# Altium project MIKSER_SIROVINE.PrjPcb (part 2 of 2)

## Sheet AnalogOutput.SchDoc: Analog output
size A3; Author: eldar6776@hotmail.com; DrawnBy: Eldar Dediæ; Organization: PROVEN d.o.o.; Address1: Adema Buæe 102; Address2: 71000 Sarajevo; Address3: Federacija BiH; Address4: Bosna i Hercegovina; DocumentNumber: DE211213; Revision: 001; SheetNumber: 6; SheetTotal: 15; ProjectName: MIKSER SIROVINE
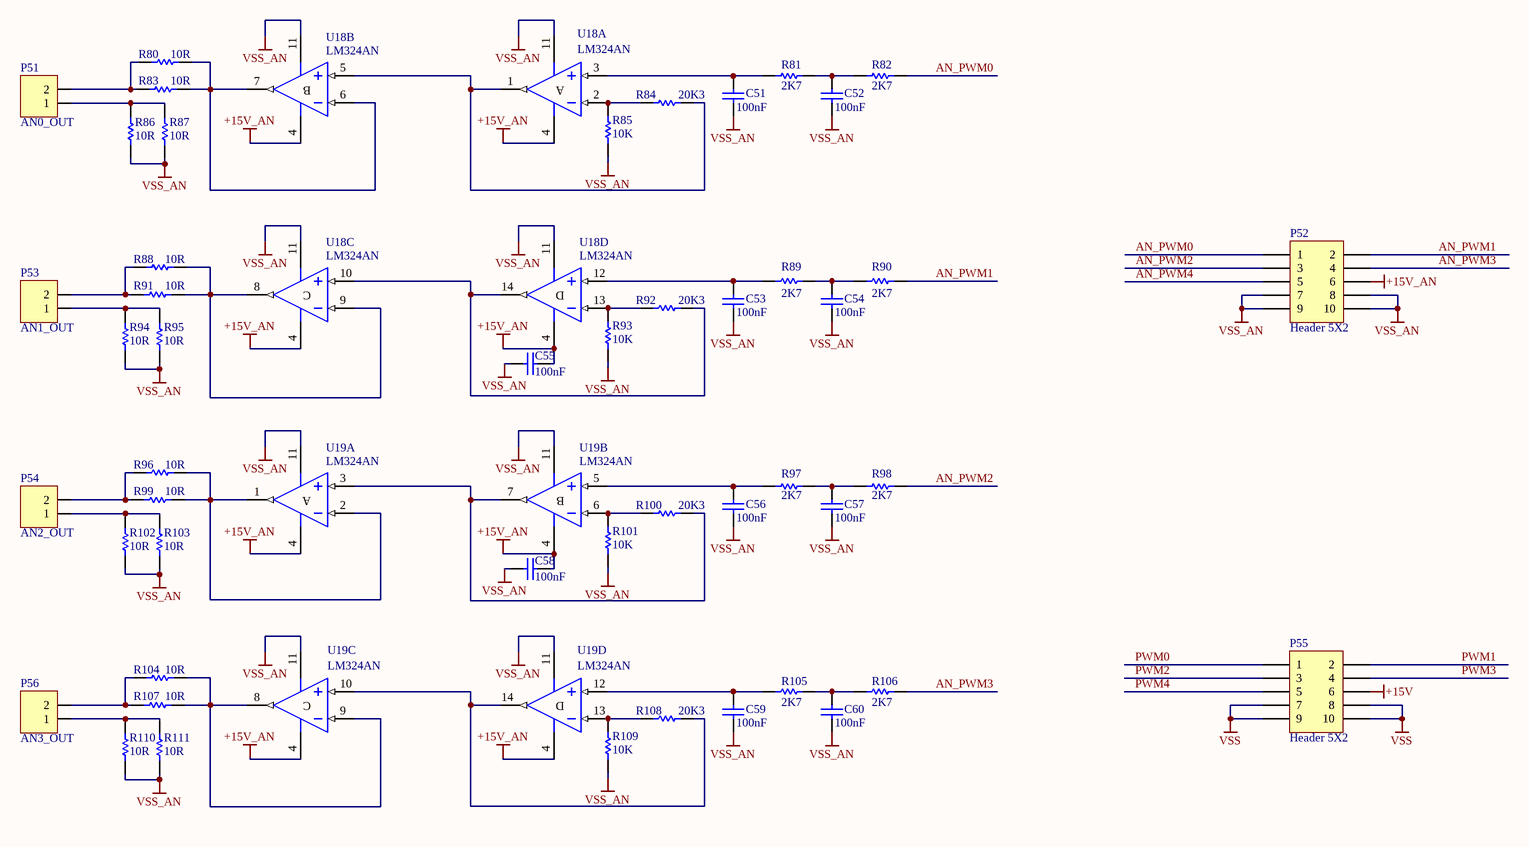
[diagram p5: AnalogOutput.SchDoc]

### Parts
C51  value 100nF  [1206]
C52  value 100nF  [1206]
C53  value 100nF  [1206]
C54  value 100nF  [1206]
C55  value 100nF  [1206]
C56  value 100nF  [1206]
C57  value 100nF  [1206]
C58  value 100nF  [1206]
C59  value 100nF  [1206]
C60  value 100nF  [1206]
P51  AN0_OUT  [TERMINAL BLOK 2]
P52  Header 5X2  [HDR2X5]
P53  AN1_OUT  [TERMINAL BLOK 2]
P54  AN2_OUT  [TERMINAL BLOK 2]
P55  Header 5X2  [HDR2X5]
P56  AN3_OUT  [TERMINAL BLOK 2]
R80  10R  [ERA-0603]
R81  2K7  [ERA-0603]
R82  2K7  [ERA-0603]
R83  10R  [ERA-0603]
R84  20K3  [ERA-0603]
R85  10K  [ERA-0603]
R86  10R  [ERA-0603]
R87  10R  [ERA-0603]
R88  10R  [ERA-0603]
R89  2K7  [ERA-0603]
R90  2K7  [ERA-0603]
R91  10R  [ERA-0603]
R92  20K3  [ERA-0603]
R93  10K  [ERA-0603]
R94  10R  [ERA-0603]
R95  10R  [ERA-0603]
R96  10R  [ERA-0603]
R97  2K7  [ERA-0603]
R98  2K7  [ERA-0603]
R99  10R  [ERA-0603]
R100  20K3  [ERA-0603]
R101  10K  [ERA-0603]
R102  10R  [ERA-0603]
R103  10R  [ERA-0603]
R104  10R  [ERA-0603]
R105  2K7  [ERA-0603]
R106  2K7  [ERA-0603]
R107  10R  [ERA-0603]
R108  20K3  [ERA-0603]
R109  10K  [ERA-0603]
R110  10R  [ERA-0603]
R111  10R  [ERA-0603]
U18  LM324AN  [DIP14]  (parts A,B,C,D of 4)
U19  LM324AN  [DIP14]  (parts A,B,C,D of 4)

### Nets
+15V: P55.6
+15V_AN: C55.1 C58.1 P52.6 U18.4(V+) U19.4(V+)
VSS: P55.7 P55.8 P55.9 P55.10
VSS_AN: C51.1 C52.1 C53.1 C54.1 C55.2 C56.1 C57.1 C58.2 C59.1 C60.1 P52.7 P52.8 P52.9 P52.10 R85.1 R86.1 R87.1 R93.1 R94.1 R95.1 R101.1 R102.1 R103.1 R109.1 R110.1 R111.1 U18.11(V-) U19.11(V-)
AN_PWM0: P52.1 R82.2
AN_PWM1: P52.2 R90.2
AN_PWM2: P52.3 R98.2
AN_PWM3: P52.4 R106.2
AN_PWM4: P52.5
PWM0: P55.1
PWM1: P55.2
PWM2: P55.3
PWM3: P55.4
PWM4: P55.5
NetC51_2: C51.2 R81.1 U18.3(IN+)
NetC52_2: C52.2 R81.2 R82.1
NetC53_2: C53.2 R89.1 U18.12(IN+)
NetC54_2: C54.2 R89.2 R90.1
NetC56_2: C56.2 R97.1 U19.5(IN+)
NetC57_2: C57.2 R97.2 R98.1
NetC59_2: C59.2 R105.1 U19.12(IN+)
NetC60_2: C60.2 R105.2 R106.1
NetP51_1: P51.1 R86.2 R87.2
NetP51_2: P51.2 R80.2 R83.2
NetP53_1: P53.1 R94.2 R95.2
NetP53_2: P53.2 R88.2 R91.2
NetP54_1: P54.1 R102.2 R103.2
NetP54_2: P54.2 R96.2 R99.2
NetP56_1: P56.1 R110.2 R111.2
NetP56_2: P56.2 R104.2 R107.2
NetR80_1: R80.1 R83.1 U18.6(IN-) U18.7(OUT)
NetR84_1: R84.1 R85.2 U18.2(IN-)
NetR84_2: R84.2 U18.1(OUT) U18.5(IN+)
NetR88_1: R88.1 R91.1 U18.8(OUT) U18.9(IN-)
NetR92_1: R92.1 R93.2 U18.13(IN-)
NetR92_2: R92.2 U18.10(IN+) U18.14(OUT)
NetR96_1: R96.1 R99.1 U19.1(OUT) U19.2(IN-)
NetR100_1: R100.1 R101.2 U19.6(IN-)
NetR100_2: R100.2 U19.3(IN+) U19.7(OUT)
NetR104_1: R104.1 R107.1 U19.8(OUT) U19.9(IN-)
NetR108_1: R108.1 R109.2 U19.13(IN-)
NetR108_2: R108.2 U19.10(IN+) U19.14(OUT)

### Notes on the sheet
- Title
- Size:
- Date:
- A3
- Number:
- Time:
- Revision:
- Sheet
- of
- File:
- (in symbol LM324AN, part A) A
- (in symbol LM324AN, part B) B
- (in symbol LM324AN, part C) C
- (in symbol LM324AN, part D) D

### Library data of the parts
C51-C60 = C1206: Ceramic Chip Capacitor - Standard; Published: 17-Jul-2002; LatestRevisionDate: 19-Mar-2004; LatestRevisionNote: Silkscreen size reduced.; DatasheetDocument: Mar-2001; PackageDocument: Mar-2001; PackageReference: 1206; Publisher: Altium Limited; Code_JEITA: 1206; Code_IPC: 3216 [1206]; ComponentLink1Description: Manufacturer Link; ComponentLink1URL: http://www.kemet.com/; ComponentLink2Description: Datasheet; ComponentLink2URL: http://www.kemet.com/kemet/web/homepage/kechome.nsf/vapubfilesname/F3102TA.pdf/$file/F3102TA.pdf
P51 P53 P54 P56 = TERMINAL BLOK 2: Terminal blok konektor 3,5 mm
P52 P55 = Header 5X2: Header, 5-Pin, Dual row; LatestRevisionDate: 17-Jul-2002; LatestRevisionNote: Re-released for DXP Platform.; Publisher: Altium Limited
R80-R111 = ERA3Y: Rectangular Thick Film Chip Resistor, 10 Ohm to 330k Ohm Range, 0.1% and 0.5% Tolerance, 0603 Size, 0.063 W; Note: If flow soldering, adjust pad width of PCB Footprint to 0.7 - 0.8 times the width of the resistor.; Published: 17-Dec-2003; LatestRevisionDate: 19-Mar-2004; LatestRevisionNote: Silkscreen size reduced.; PackageDocument: Mar-2003; PackageReference: ERA-0603; Publisher: Altium Limited; Code_IPC: 1608 [0603]; ComponentLink1Description: Manufacturer Link; ComponentLink1URL: http://www.panasonic.com/industrial/components/resistive_products.htm; ComponentLink2Description: Datasheet; ComponentLink2URL: http://www.panasonic.com/industrial/components/pdf/AOA0000CE8.pdf
U18 U19 = LM324AN: Low-Power Quad Operational Amplifier; Published: 24-Aug-2001; LatestRevisionDate: 06-Jun-2005; LatestRevisionNote: Stylized 3D Model Added.; DatasheetVersion: Nov-1997; PackageVersion: Jan-1997; PackageReference: DIP14; Publisher: Altium Limited; PackageDescription: DIP; 14 Leads; Row Spacing 7.62 mm; Pitch 2.54 mm; ComponentLink1Description: Manufacturer Link; ComponentLink1URL: http://www.st.com/; ComponentLink2Description: Datasheet; ComponentLink2URL: http://www.st.com/stonline/products/literature/ds/4797/lm224a.pdf

## Sheet CuC_ControlComm.SchDoc: CuC Control Comm
size A4; Author: eldar6776@hotmail.com; DrawnBy: Eldar Dedić; Organization: PROVEN d.o.o.; Address1: Adema Buće 102; Address2: 71000 Sarajevo; Address3: Federacija BiH; Address4: Bosna i Hercegovina; DocumentNumber: DE211213; Revision: 001; SheetNumber: 7; SheetTotal: 15; ProjectName: MIKSER SIROVINE
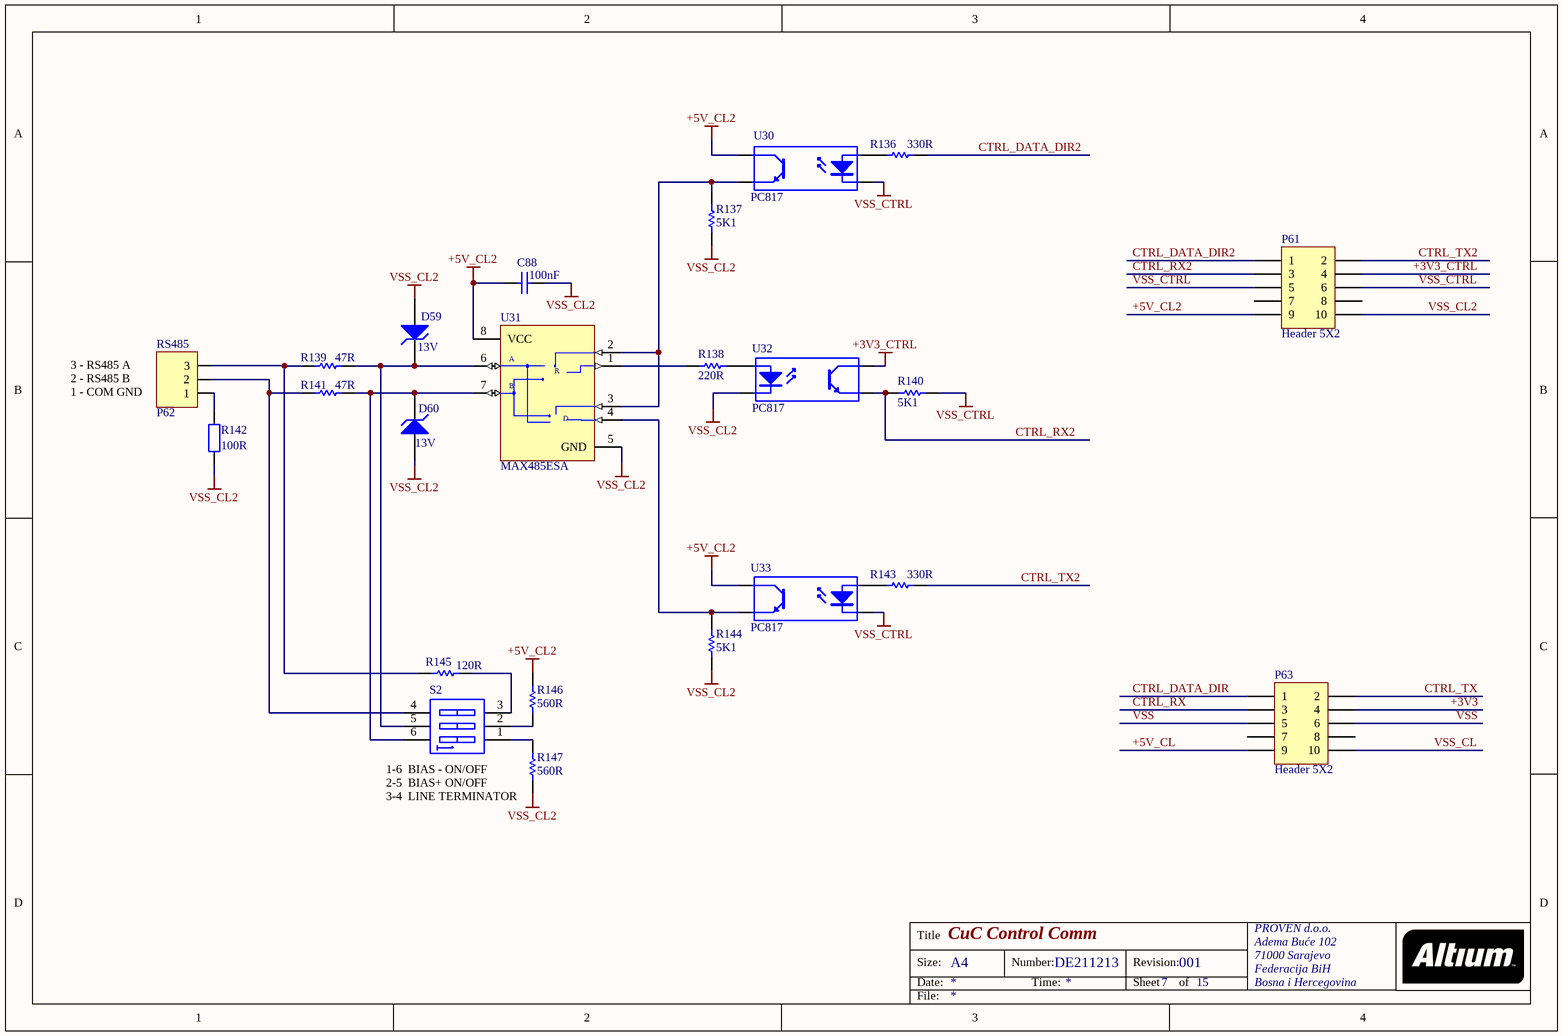
[diagram p6: CuC_ControlComm.SchDoc]

### Parts
C88  100nF  [1206]
D59  13V  [DO-35A]
D60  13V  [DO-35A]
P61  Header 5X2  [HDR2X5]
P62  RS485  [TERMINAL BLOK 3]
P63  Header 5X2  [HDR2X5]
R136  330R  [ERA-0805]
R137  5K1  [8-1206]
R138  220R  [ERA-0805]
R139  47R  [ERA-0805]
R140  5K1  [8-1206]
R141  47R  [ERA-0805]
R142  100R  [AXIAL-0.4]
R143  330R  [ERA-0805]
R144  5K1  [8-1206]
R145  120R  [ERA-0805]
R146  560R  [ERA-0805]
R147  560R  [ERA-0805]
S2  (no value)  [DIP-6]
U30  PC817  [DIP-4]
U31  MAX485ESA  [NSO8_N]
U32  PC817  [DIP-4]
U33  PC817  [DIP-4]

### Nets
+3V3: P63.4
+3V3_CTRL: P61.4 U32.4(C)
+5V_CL: P63.9
+5V_CL2: C88.2 P61.9 R146.2 U30.4(C) U31.8(VCC) U33.4(C)
VSS: P63.5 P63.6
VSS_CL: P63.10
VSS_CL2: C88.1 D59.1(A) D60.1(A) P61.10 R137.1 R142.1 R144.1 R147.1 U31.5(GND) U32.2(K)
VSS_CTRL: P61.5 P61.6 R140.2 U30.2(K) U33.2(K)
CTRL_DATA_DIR: P63.1
CTRL_DATA_DIR2: P61.1 R136.2
CTRL_RX: P63.3
CTRL_RX2: P61.3 R140.1 U32.3(E)
CTRL_TX: P63.2
CTRL_TX2: P61.2 R143.2
NetD59_2: D59.2(K) R139.2 S2.5(B2) U31.6(A)
NetD60_2: D60.2(K) R141.2 S2.6(B1) U31.7(B)
NetP62_1: P62.1 R142.2
NetP62_2: P62.2 R141.1 S2.4(B3)
NetP62_3: P62.3 R139.1 R145.1
NetR136_1: R136.1 U30.1(A)
NetR137_2: R137.2 U30.3(E) U31.2(~{RE}) U31.3(DE)
NetR138_1: R138.1 U32.1(A)
NetR138_2: R138.2 U31.1(RO)
NetR143_1: R143.1 U33.1(A)
NetR144_2: R144.2 U31.4(DI) U33.3(E)
NetR145_2: R145.2 S2.3(A3)
NetR146_1: R146.1 S2.2(A2)
NetR147_2: R147.2 S2.1(A1)

Not connected (* = marked no-connect by the designer): P61 7 8; P63 7 8

### Notes on the sheet
- 3 - RS485 A
  2 - RS485 B
  1 - COM GND
- (near R147) 1-6  BIAS - ON/OFF
  2-5  BIAS+ ON/OFF
  3-4  LINE TERMINATOR
- Title
- Size:
- Date:
- A4
- Number:
- Time:
- Revision:
- Sheet
- of
- File:
- (in symbol MAX485ESA) R; D

### Library data of the parts
C88 = C1206: Ceramic Chip Capacitor - Standard; Published: 17-Jul-2002; LatestRevisionDate: 19-Mar-2004; LatestRevisionNote: Silkscreen size reduced.; DatasheetDocument: Mar-2001; PackageDocument: Mar-2001; PackageReference: 1206; Publisher: Altium Limited; Code_JEITA: 1206; Code_IPC: 3216 [1206]; ComponentLink1Description: Manufacturer Link; ComponentLink1URL: http://www.kemet.com/; ComponentLink2Description: Datasheet; ComponentLink2URL: http://www.kemet.com/kemet/web/homepage/kechome.nsf/vapubfilesname/F3102TA.pdf/$file/F3102TA.pdf
D59 D60 = D Zener: Zener Diode; Published: 8-Jun-2000; LatestRevisionDate: 17-Jul-2002; LatestRevisionNote: Re-released for DXP Platform.; PackageReference: DIODE-0.7; Publisher: Altium Limited; PackageDescription: Diode, Thru-Hole; 2 Leads; 0.7 in Pin Spacing
P61 P63 = Header 5X2: Header, 5-Pin, Dual row; LatestRevisionDate: 17-Jul-2002; LatestRevisionNote: Re-released for DXP Platform.; Publisher: Altium Limited
P62 = TERMINAL BLOK 3: 3 pinski terminal blok konektor
R136 R143 = ERA6Y: Rectangular Thick Film Chip Resistor, 10 Ohm to 1M Ohm Range, 0.1% and 0.5% Tolerance, 0805 Size, 0.1 W; Note: If flow soldering, adjust pad width of PCB Footprint to 0.7 - 0.8 times the width of the resistor.; Published: 17-Dec-2003; LatestRevisionDate: 19-Mar-2004; LatestRevisionNote: Silkscreen size reduced.; PackageDocument: Mar-2003; PackageReference: ERA-0805; Publisher: Altium Limited; Code_IPC: 2012 [0805]; ComponentLink1Description: Manufacturer Link; ComponentLink1URL: http://www.panasonic.com/industrial/components/resistive_products.htm; ComponentLink2Description: Datasheet; ComponentLink2URL: http://www.panasonic.com/industrial/components/pdf/AOA0000CE8.pdf
R137 R140 R144 = ERJ8GE: Thick Film Chip Resistor, 1 Ohm to 10M Ohm Range, 5% Tolerance, 1206 Size, 0.25 W; Note: If flow soldering, adjust pad width of PCB Footprint to 0.7 - 0.8 times the width of the resistor.; Published: 17-Dec-2003; LatestRevisionDate: 19-Mar-2004; LatestRevisionNote: Silkscreen size reduced.; PackageDocument: Mar-2003; PackageReference: 8-1206; Publisher: Altium Limited; Code_IPC: 3216 [1206]; ComponentLink1Description: Manufacturer Link; ComponentLink1URL: http://www.panasonic.com/industrial/components/resistive_products.htm; ComponentLink2Description: Datasheet; ComponentLink2URL: http://www.panasonic.com/industrial/components/pdf/AOA0000CE1.pdf
R138 R139 R141 R145-R147 = ERAS: Metal Film Thermosensitive Chip Resistor, 0.56 Ohm to 10k Ohm Range, 5% Tolerance, 0805 Size, 0.1 W; Note: If flow soldering, adjust pad width of PCB Footprint to 0.7 - 0.8 times the width of the resistor.; Published: 17-Dec-2003; LatestRevisionDate: 19-Mar-2004; LatestRevisionNote: Silkscreen size reduced.; PackageDocument: Mar-2003; PackageReference: ERA-0805; Publisher: Altium Limited; Code_IPC: 2012 [0805]; ComponentLink1Description: Manufacturer Link; ComponentLink1URL: http://www.panasonic.com/industrial/components/resistive_products.htm; ComponentLink2Description: Datasheet; ComponentLink2URL: http://www.panasonic.com/industrial/components/pdf/AOF0000CE1.pdf
R142 = Res2: Resistor; Published: 8-Jun-2000; LatestRevisionDate: 17-Jul-2002; LatestRevisionNote: Re-released for DXP Platform.; PackageReference: AXIAL-0.4; Publisher: Altium Limited; PackageDescription: Axial Device, Thru-Hole; 2 Leads; 0.4 in Pin Spacing
S2 = SW DIP-3: DIP Switch, 3 Position, SPST; Published: 24-Mar-1999; LatestRevisionDate: 17-Jul-2002; LatestRevisionNote: Re-released for DXP Platform.; PackageReference: DIP-6; Publisher: Altium Limited; Code_JEDEC: MO-001-AM
U30 U32 U33 = Optoisolator1: 4-Pin Phototransistor Optocoupler; Published: 24-Mar-1999; LatestRevisionDate: 04-Mar-2005; LatestRevisionNote: Sch pins 3 & 4 Swapped.; DatasheetVersion: Nov-2003; PackageReference: DIP-4; Publisher: Altium Limited
U31 = MAX485ESA: Low-Power, Slew-Rate-Limited RS-485/RS-422 Transceiver; Published: 16-Jan-2001; LatestRevisionDate: 13-Apr-2006; LatestRevisionNote: IPC-7351 Footprint Added.; DatasheetVersion: Feb-1996; PackageReference: NSO8; Publisher: Altium Limited; PackageDescription: 8-Pin Small Outline Integrated Circuit 1.27 mm Pitch; Code_JEDEC: MS-012-AA; Code_IPC: SOIC127P600-8; ComponentLink1Description: Manufacturer Link; ComponentLink1URL: http://www.maxim-ic.com/; ComponentLink2Description: Datasheet; ComponentLink2URL: http://pdfserv.maxim-ic.com/en/ds/MAX1487-MAX491.pdf

## Sheet CuC_DataComm.SchDoc: CuC Data Comm
size A4; Author: eldar6776@hotmail.com; DrawnBy: Eldar Dedić; Organization: PROVEN d.o.o.; Address1: Adema Buće 102; Address2: 71000 Sarajevo; Address3: Federacija BiH; Address4: Bosna i Hercegovina; DocumentNumber: DE211213; Revision: 001; SheetNumber: 8; SheetTotal: 15; ProjectName: MIKSER SIROVINE
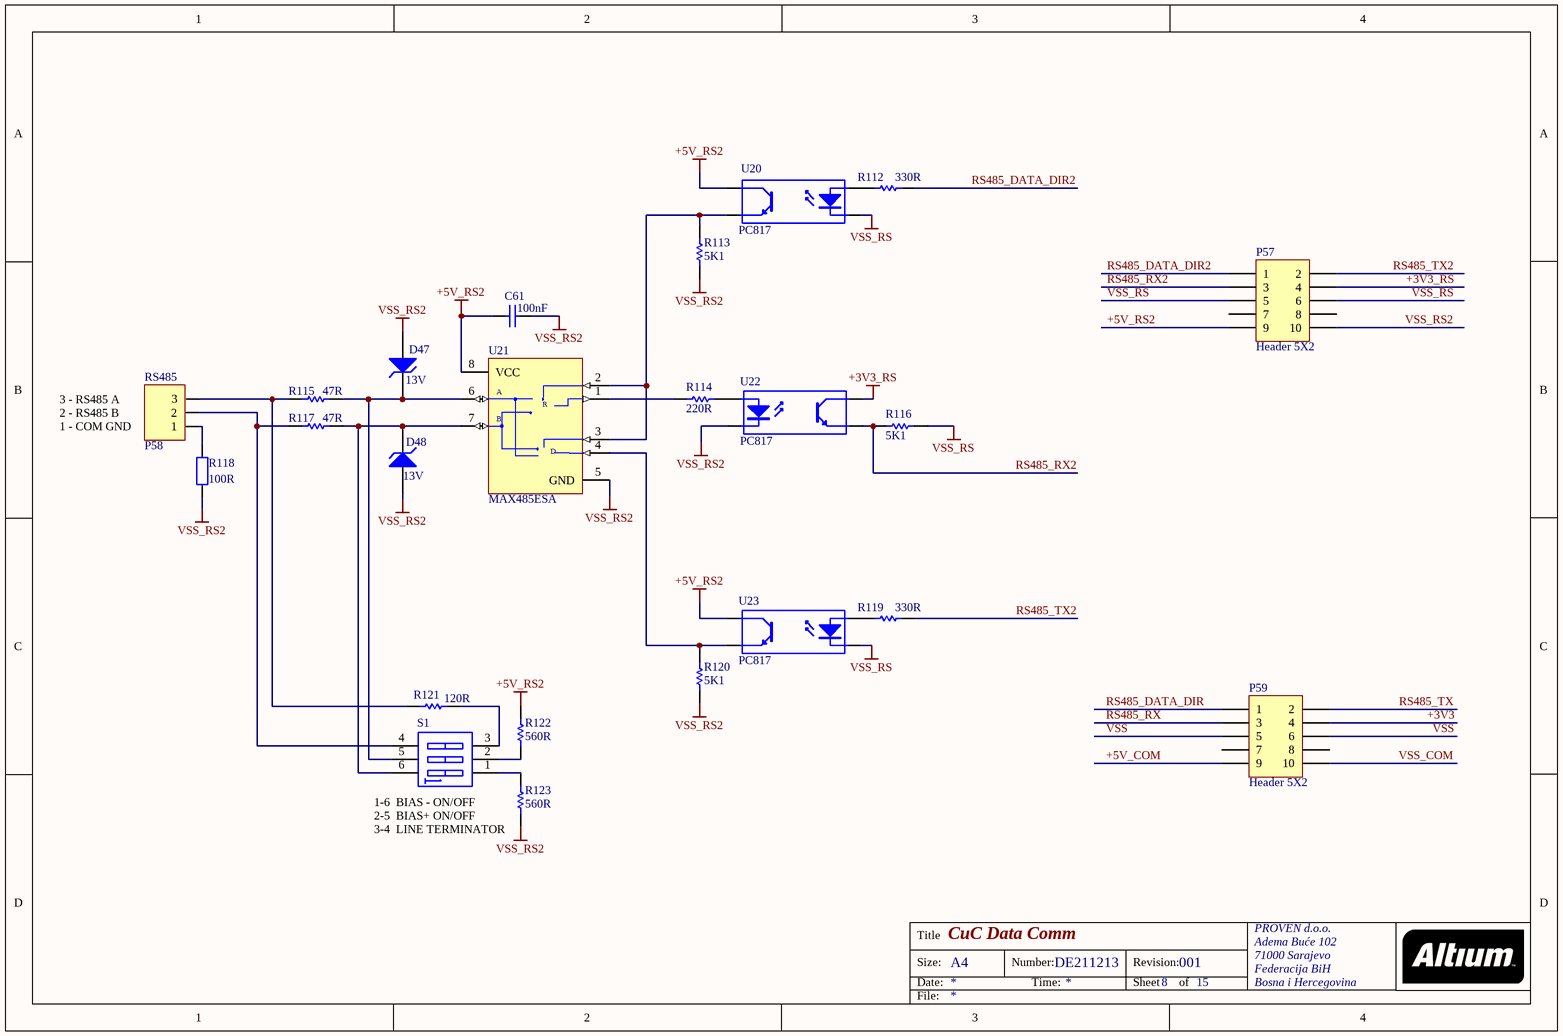
[diagram p7: CuC_DataComm.SchDoc]

### Parts
C61  100nF  [1206]
D47  13V  [DO-35A]
D48  13V  [DO-35A]
P57  Header 5X2  [HDR2X5]
P58  RS485  [TERMINAL BLOK 3]
P59  Header 5X2  [HDR2X5]
R112  330R  [ERA-0805]
R113  5K1  [8-1206]
R114  220R  [ERA-0805]
R115  47R  [ERA-0805]
R116  5K1  [8-1206]
R117  47R  [ERA-0805]
R118  100R  [AXIAL-0.4]
R119  330R  [ERA-0805]
R120  5K1  [8-1206]
R121  120R  [ERA-0805]
R122  560R  [ERA-0805]
R123  560R  [ERA-0805]
S1  (no value)  [DIP-6]
U20  PC817  [DIP-4]
U21  MAX485ESA  [NSO8_N]
U22  PC817  [DIP-4]
U23  PC817  [DIP-4]

### Nets
+3V3: P59.4
+3V3_RS: P57.4 U22.4(C)
+5V_COM: P59.9
+5V_RS2: C61.2 P57.9 R122.2 U20.4(C) U21.8(VCC) U23.4(C)
VSS: P59.5 P59.6
VSS_COM: P59.10
VSS_RS: P57.5 P57.6 R116.2 U20.2(K) U23.2(K)
VSS_RS2: C61.1 D47.1(A) D48.1(A) P57.10 R113.1 R118.1 R120.1 R123.1 U21.5(GND) U22.2(K)
RS485_DATA_DIR: P59.1
RS485_DATA_DIR2: P57.1 R112.2
RS485_RX: P59.3
RS485_RX2: P57.3 R116.1 U22.3(E)
RS485_TX: P59.2
RS485_TX2: P57.2 R119.2
NetD47_2: D47.2(K) R115.2 S1.5(B2) U21.6(A)
NetD48_2: D48.2(K) R117.2 S1.6(B1) U21.7(B)
NetP58_1: P58.1 R118.2
NetP58_2: P58.2 R117.1 S1.4(B3)
NetP58_3: P58.3 R115.1 R121.1
NetR112_1: R112.1 U20.1(A)
NetR113_2: R113.2 U20.3(E) U21.2(~{RE}) U21.3(DE)
NetR114_1: R114.1 U22.1(A)
NetR114_2: R114.2 U21.1(RO)
NetR119_1: R119.1 U23.1(A)
NetR120_2: R120.2 U21.4(DI) U23.3(E)
NetR121_2: R121.2 S1.3(A3)
NetR122_1: R122.1 S1.2(A2)
NetR123_2: R123.2 S1.1(A1)

Not connected (* = marked no-connect by the designer): P57 7 8; P59 7 8

### Notes on the sheet
- 3 - RS485 A
  2 - RS485 B
  1 - COM GND
- (near R123) 1-6  BIAS - ON/OFF
  2-5  BIAS+ ON/OFF
  3-4  LINE TERMINATOR
- Title
- Size:
- Date:
- A4
- Number:
- Time:
- Revision:
- Sheet
- of
- File:
- (in symbol MAX485ESA) R; D

### Library data of the parts
C61 = C1206: Ceramic Chip Capacitor - Standard; Published: 17-Jul-2002; LatestRevisionDate: 19-Mar-2004; LatestRevisionNote: Silkscreen size reduced.; DatasheetDocument: Mar-2001; PackageDocument: Mar-2001; PackageReference: 1206; Publisher: Altium Limited; Code_JEITA: 1206; Code_IPC: 3216 [1206]; ComponentLink1Description: Manufacturer Link; ComponentLink1URL: http://www.kemet.com/; ComponentLink2Description: Datasheet; ComponentLink2URL: http://www.kemet.com/kemet/web/homepage/kechome.nsf/vapubfilesname/F3102TA.pdf/$file/F3102TA.pdf
D47 D48 = D Zener: Zener Diode; Published: 8-Jun-2000; LatestRevisionDate: 17-Jul-2002; LatestRevisionNote: Re-released for DXP Platform.; PackageReference: DIODE-0.7; Publisher: Altium Limited; PackageDescription: Diode, Thru-Hole; 2 Leads; 0.7 in Pin Spacing
P57 P59 = Header 5X2: Header, 5-Pin, Dual row; LatestRevisionDate: 17-Jul-2002; LatestRevisionNote: Re-released for DXP Platform.; Publisher: Altium Limited
P58 = TERMINAL BLOK 3: 3 pinski terminal blok konektor
R112 R119 = ERA6Y: as R136 on sheet CuC_ControlComm; Published: 17-Dec-2003; LatestRevisionDate: 19-Mar-2004; LatestRevisionNote: Silkscreen size reduced.; PackageDocument: Mar-2003; PackageReference: ERA-0805; Publisher: Altium Limited; Code_IPC: 2012 [0805]; ComponentLink1Description: Manufacturer Link; ComponentLink1URL: http://www.panasonic.com/industrial/components/resistive_products.htm; ComponentLink2Description: Datasheet; ComponentLink2URL: http://www.panasonic.com/industrial/components/pdf/AOA0000CE8.pdf
R113 R116 R120 = ERJ8GE: as R137 on sheet CuC_ControlComm; Published: 17-Dec-2003; LatestRevisionDate: 19-Mar-2004; LatestRevisionNote: Silkscreen size reduced.; PackageDocument: Mar-2003; PackageReference: 8-1206; Publisher: Altium Limited; Code_IPC: 3216 [1206]; ComponentLink1Description: Manufacturer Link; ComponentLink1URL: http://www.panasonic.com/industrial/components/resistive_products.htm; ComponentLink2Description: Datasheet; ComponentLink2URL: http://www.panasonic.com/industrial/components/pdf/AOA0000CE1.pdf
R114 R115 R117 R121-R123 = ERAS: as R138 on sheet CuC_ControlComm; Published: 17-Dec-2003; LatestRevisionDate: 19-Mar-2004; LatestRevisionNote: Silkscreen size reduced.; PackageDocument: Mar-2003; PackageReference: ERA-0805; Publisher: Altium Limited; Code_IPC: 2012 [0805]; ComponentLink1Description: Manufacturer Link; ComponentLink1URL: http://www.panasonic.com/industrial/components/resistive_products.htm; ComponentLink2Description: Datasheet; ComponentLink2URL: http://www.panasonic.com/industrial/components/pdf/AOF0000CE1.pdf
R118 = Res2: Resistor; Published: 8-Jun-2000; LatestRevisionDate: 17-Jul-2002; LatestRevisionNote: Re-released for DXP Platform.; PackageReference: AXIAL-0.4; Publisher: Altium Limited; PackageDescription: Axial Device, Thru-Hole; 2 Leads; 0.4 in Pin Spacing
S1 = SW DIP-3: DIP Switch, 3 Position, SPST; Published: 24-Mar-1999; LatestRevisionDate: 17-Jul-2002; LatestRevisionNote: Re-released for DXP Platform.; PackageReference: DIP-6; Publisher: Altium Limited; Code_JEDEC: MO-001-AM
U20 U22 U23 = Optoisolator1: 4-Pin Phototransistor Optocoupler; Published: 24-Mar-1999; LatestRevisionDate: 04-Mar-2005; LatestRevisionNote: Sch pins 3 & 4 Swapped.; DatasheetVersion: Nov-2003; PackageReference: DIP-4; Publisher: Altium Limited
U21 = MAX485ESA: as U31 on sheet CuC_ControlComm; Published: 16-Jan-2001; LatestRevisionDate: 13-Apr-2006; LatestRevisionNote: IPC-7351 Footprint Added.; DatasheetVersion: Feb-1996; PackageReference: NSO8; Publisher: Altium Limited; PackageDescription: 8-Pin Small Outline Integrated Circuit 1.27 mm Pitch; Code_JEDEC: MS-012-AA; Code_IPC: SOIC127P600-8; ComponentLink1Description: Manufacturer Link; ComponentLink1URL: http://www.maxim-ic.com/; ComponentLink2Description: Datasheet; ComponentLink2URL: http://pdfserv.maxim-ic.com/en/ds/MAX1487-MAX491.pdf

## Nets that join several sheets
+3V3: CuC_PSU (5 pins), CuC (13 pins), CuC_ControlComm (P63.4), CuC_DataComm (P59.4)
+5V: CuC_PSU (8 pins), CuC (P1.9 P2.9 P3.9 P5.9), DigitalInput (12 pins), DigitalOutput (P49.1 P49.2)
+5V_CL: CuC_PSU (C84.2 C86.1 U29.1), CuC_ControlComm (P63.9)
+5V_COM: CuC_PSU (C79.2 C81.1 U28.1), CuC_DataComm (P59.9)
+15V: CuC_PSU (C65.1 C69.2 U25.1), AnalogOutput (P55.6)
+24V: CuC_PSU (10 pins), CuC (P6.9 P6.10), DigitalInput (R31.2 R32.2 R33.2 R34.2)
VSS: CuC_PSU (25 pins), CuC (19 pins), DigitalInput (76 pins), DigitalOutput (8 pins), AnalogOutput (P55.7 P55.8 P55.9 P55.10), CuC_ControlComm (P63.5 P63.6), CuC_DataComm (P59.5 P59.6)
VSS_CL: CuC_PSU (7 pins), CuC_ControlComm (P63.10)
VSS_COM: CuC_PSU (7 pins), CuC_DataComm (P59.10)
CTRL_DATA_DIR: CuC (U1.2), CuC_ControlComm (P63.1)
CTRL_RX: CuC (U1.5), CuC_ControlComm (P63.3)
CTRL_TX: CuC (U1.4), CuC_ControlComm (P63.2)
DATA0: CuC (P3.1 R3.2), DigitalInput (U2.18 U3.18 U4.18 U5.18), DigitalOutput (P47.1)
DATA1: CuC (P3.2 R4.2), DigitalInput (U2.16 U3.16 U4.16 U5.16), DigitalOutput (P47.2)
DATA2: CuC (P3.3 R5.2), DigitalInput (U2.14 U3.14 U4.14 U5.14), DigitalOutput (P47.3)
DATA3: CuC (P3.4 R7.2), DigitalInput (U2.12 U3.12 U4.12 U5.12), DigitalOutput (P47.4)
DATA4: CuC (P3.5 R8.2), DigitalInput (U2.9 U3.9 U4.9 U5.9), DigitalOutput (P47.5)
DATA5: CuC (P3.6 R9.2), DigitalInput (U2.7 U3.7 U4.7 U5.7), DigitalOutput (P47.6)
DATA6: CuC (P3.7 R10.2), DigitalInput (U2.5 U3.5 U4.5 U5.5), DigitalOutput (P47.7)
DATA7: CuC (P3.8 R11.2), DigitalInput (U2.3 U3.3 U4.3 U5.3), DigitalOutput (P47.8)
DOUT_CLK: CuC (U1.34), DigitalOutput (P47.9)
INPUT_1_8: CuC (U1.1), DigitalInput (R14.1 U3.1 U3.19)
INPUT_9_16: CuC (U1.64), DigitalInput (R13.1 U2.1 U2.19)
INPUT_17_24: CuC (U1.63), DigitalInput (R40.1 U5.1 U5.19)
INPUT_25_32: CuC (U1.62), DigitalInput (R39.1 U4.1 U4.19)
OUTPUT_ENABLE: CuC (P6.1 R6.1 U1.35), DigitalOutput (P47.10)
PWM0: CuC (U1.33), AnalogOutput (P55.1)
PWM1: CuC (U1.59), AnalogOutput (P55.2)
PWM2: CuC (U1.3), AnalogOutput (P55.3)
PWM3: CuC (U1.6), AnalogOutput (P55.4)
PWM4: CuC (U1.8), AnalogOutput (P55.5)
RS485_DATA_DIR: CuC (U1.36), CuC_DataComm (P59.1)
RS485_RX: CuC (U1.32), CuC_DataComm (P59.3)
RS485_TX: CuC (U1.31), CuC_DataComm (P59.2)